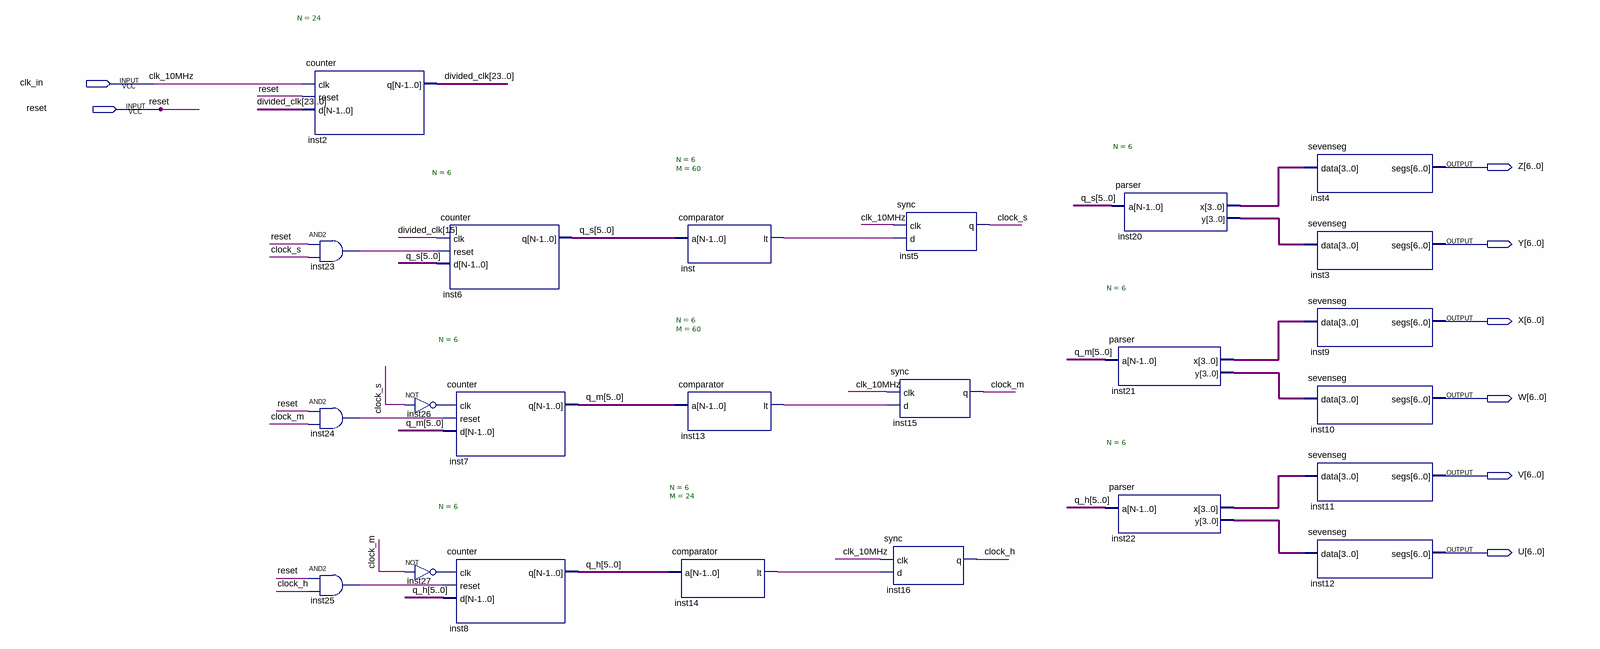
[diagram p0: schematic sheet]
// Quartus schematic LAB5.bdf as structural Verilog: 24 symbols, 8 pins
module LAB5 (
  input  clk_in,
  input  reset,
  output [6:0] Z,
  output [6:0] Y,
  output [6:0] X,
  output [6:0] W,
  output [6:0] V,
  output [6:0] U
);

  wire clock_h, clock_m, clock_s, inst13_lt, inst14_lt, inst23_out, inst24_out, inst25_out, inst26_out,
       inst27_out, inst_lt;
  wire [3:0] inst20_x, inst20_y, inst21_x, inst21_y, inst22_x, inst22_y;
  wire [5:0] q_h, q_m, q_s;
  wire [23:0] divided_clk;

  counter #(.N(24)) inst2 (.clk(clk_in), .reset(reset), .d(divided_clk), .q(divided_clk));
  and inst23 (inst23_out, reset, clock_s);
  and inst24 (inst24_out, reset, clock_m);
  and inst25 (inst25_out, reset, clock_h);
  counter #(.N(6)) inst6 (.clk(divided_clk[15]), .reset(inst23_out), .d(q_s), .q(q_s));
  not inst26 (inst26_out, clock_s);
  not inst27 (inst27_out, clock_m);
  counter #(.N(6)) inst7 (.clk(inst26_out), .reset(inst24_out), .d(q_m), .q(q_m));
  counter #(.N(6)) inst8 (.clk(inst27_out), .reset(inst25_out), .d(q_h), .q(q_h));
  comparator #(.N(6), .M(60)) inst (.a(q_s), .lt(inst_lt));
  comparator #(.N(6), .M(60)) inst13 (.a(q_m), .lt(inst13_lt));
  comparator #(.N(6), .M(24)) inst14 (.a(q_h), .lt(inst14_lt));
  sync inst5 (.clk(clk_in), .d(inst_lt), .q(clock_s));
  sync inst15 (.clk(clk_in), .d(inst13_lt), .q(clock_m));
  sync inst16 (.clk(clk_in), .d(inst14_lt), .q(clock_h));
  parser #(.N(6)) inst21 (.a(q_m), .x(inst21_x), .y(inst21_y));
  parser #(.N(6)) inst22 (.a(q_h), .x(inst22_x), .y(inst22_y));
  parser #(.N(6)) inst20 (.a(q_s), .x(inst20_x), .y(inst20_y));
  sevenseg inst4 (.data(inst20_x), .segs(Z));
  sevenseg inst3 (.data(inst20_y), .segs(Y));
  sevenseg inst9 (.data(inst21_x), .segs(X));
  sevenseg inst10 (.data(inst21_y), .segs(W));
  sevenseg inst11 (.data(inst22_x), .segs(V));
  sevenseg inst12 (.data(inst22_y), .segs(U));

  // Other names for the same wires on the sheet: clk_10MHz = clk_in
endmodule
